# EAGLE design Mirtle_2018_drv8833 (EAGLE 6.6.0)
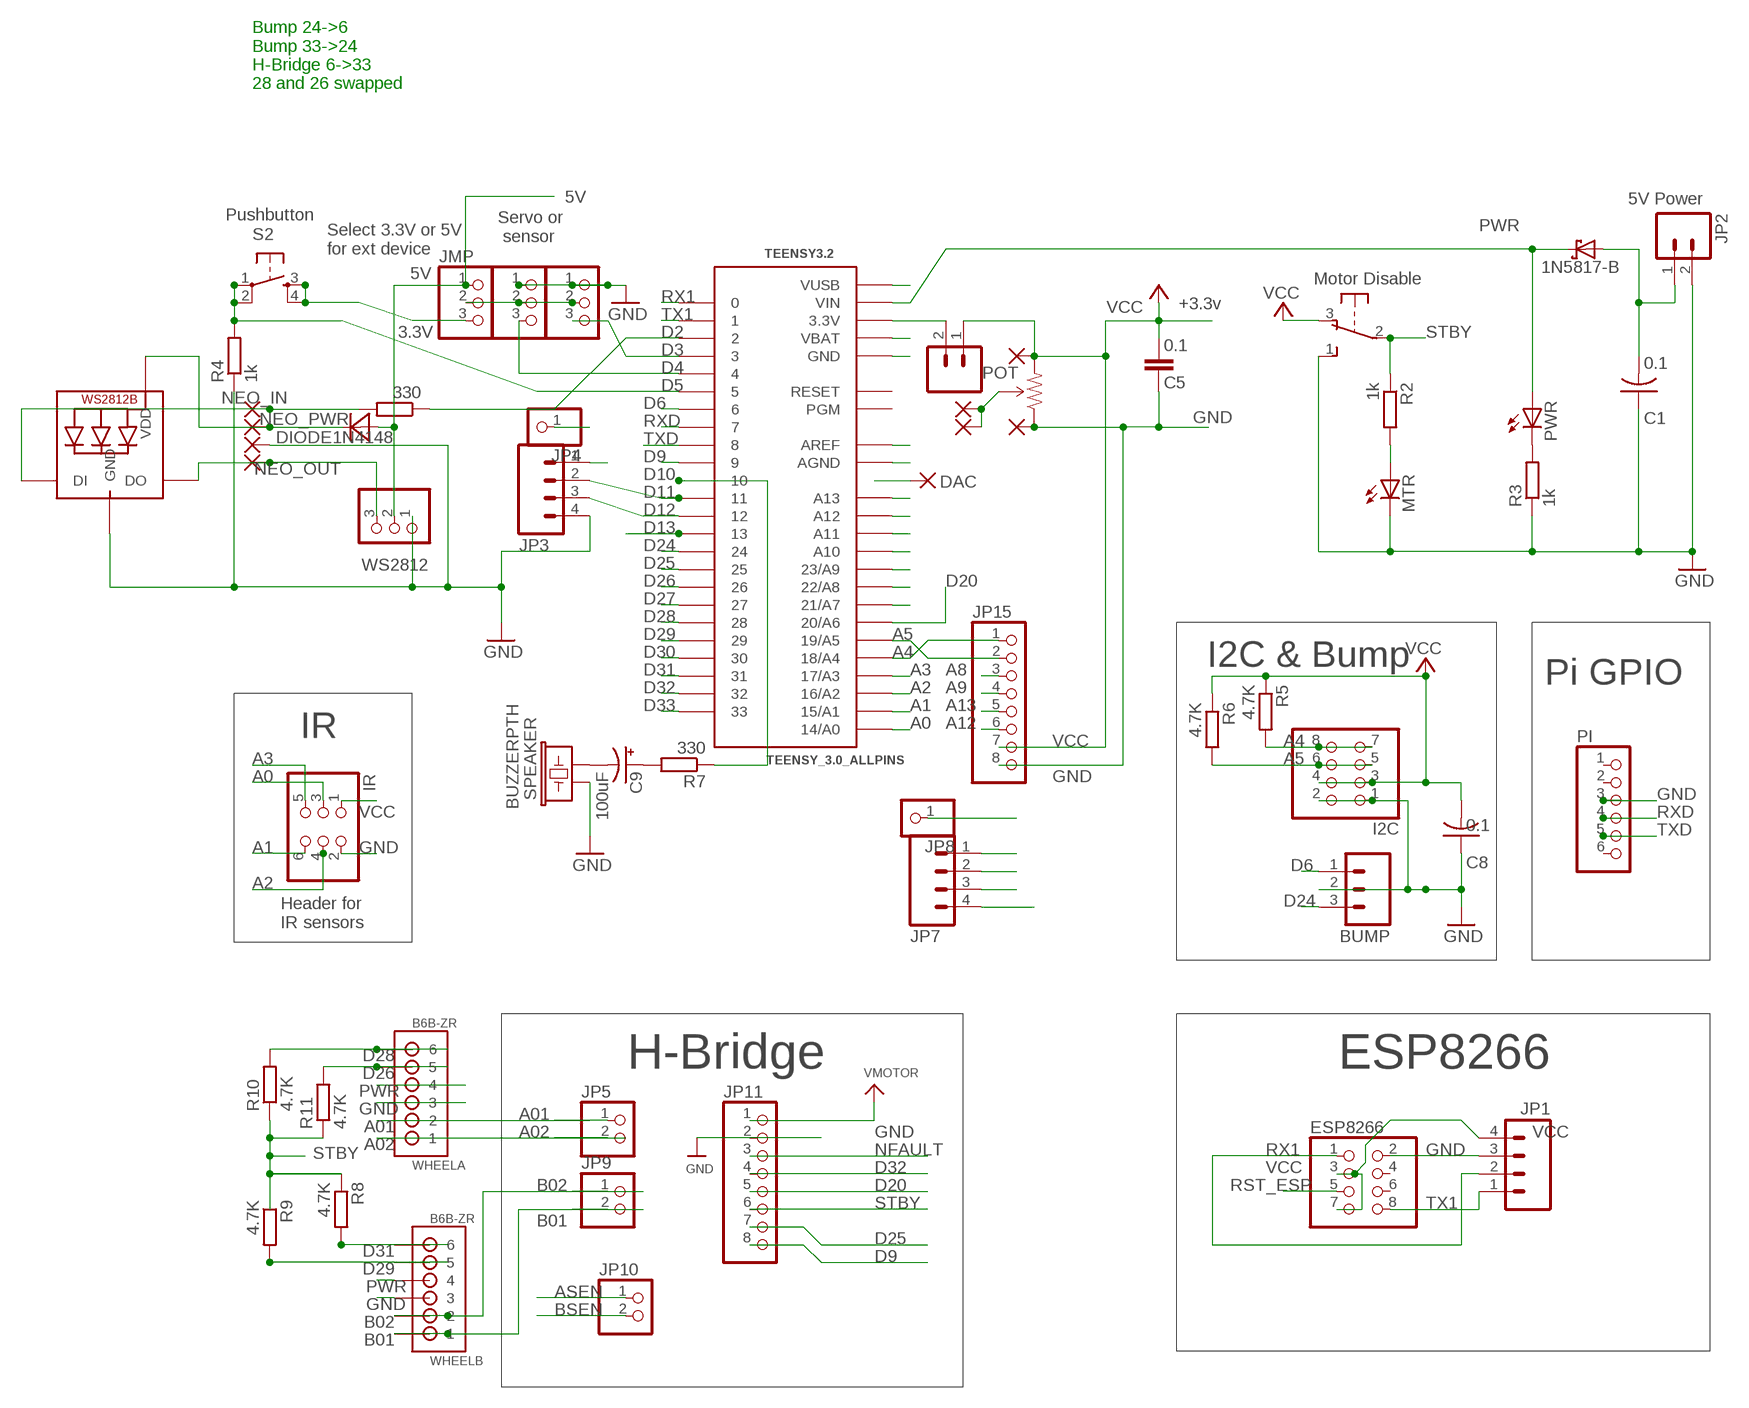
[diagram p0: schematic, sheet 1]

## Parts
3V3  M02PTH  [1X02]
BUMP  M03SCREW  [SCREWTERMINAL-3.5MM-3]
C1  0.1  C-US025-024X044  [C025-024X044]
C5  0.1  CAPEZ  [CAP-PTH-SMALLEZ]
C8  0.1  C-US025-024X044  [C025-024X044]
C9  100uF  CPOL-USE2.5-5  [E2,5-5]
D1  1N5817-B  [DO41-7.6]
D3  DIODE1N4148  [DO-35]
DAC  1,6/0,8  [1,6/0,8]
ESP8266  PINHD-2X4  [2X04]
EXT  PINHD-1X3  [1X03]
EXT1  PINHD-1X3  [1X03]
I2C  PINHD-2X4  [2X04]
IR  PINHD-2X3  [2X03]
JMP  PINHD-1X3  [1X03]
JP1  M04PTH  [1X04]
JP2  M023.5MM  [SCREWTERMINAL-3.5MM-2]
JP3  M04PTH  [1X04]
JP4  PINHD-1X1  [1X01]
JP5  HEADER-1X2ROUND  [1X02_ROUND]
JP7  M04PTH  [1X04]
JP8  PINHD-1X1  [1X01]
JP9  HEADER-1X2ROUND  [1X02_ROUND]
JP10  HEADER-1X2ROUND  [1X02_ROUND]
JP11  HEADER-1X870MIL  [1X08_ROUND_70]
JP15  PINHD-1X8BIG  [1X08-BIG]
LED1  WS2812B5050  [WS2812B]
MTR  LED3MM  [LED3MM]
PAD2  1,6/0,8  [1,6/0,8]
PAD3  1,6/0,8  [1,6/0,8]
PAD4  1,6/0,8  [1,6/0,8]
PAD5  1,6/0,8  [1,6/0,8]
PAD6  1,6/0,8  [1,6/0,8]
PAD7  1,6/0,8  [1,6/0,8]
PAD8  1,6/0,8  [1,6/0,8]
PAD9  1,6/0,8  [1,6/0,8]
PI  PINHD-1X6  [1X06]
POT  TSR-3386  TRIMPOT-PTH-KNOB  [3386U]
PWR  LED3MM  [LED3MM]
R2  1k  R-EU_0204/7  [0204/7]
R3  1k  R-EU_0204/7  [0204/7]
R4  1k  R-EU_0204/7  [0204/7]
R5  4.7K  R-EU_0204/7  [0204/7]
R6  4.7K  R-EU_0204/7  [0204/7]
R7  330  R-EU_0204/7  [0204/7]
R8  4.7K  R-EU_0204/5  [0204/5]
R9  4.7K  R-EU_0204/5  [0204/5]
R10  4.7K  R-EU_0204/5  [0204/5]
R11  4.7K  R-EU_0204/5  [0204/5]
R12  330  R-EU_0204/5  [0204/5]
S2  TAC_SWITCHPTH  [TACTILE-PTH]
SPEAKER  BUZZERPTH  [BUZZER-12MM]
SW1  OS102011MA1Q  [OS102011MA1Q]
TEENSY3.2  TEENSY_3.0_ALLPINS  [TEENSY_3.0_ALLPINS]
WHEELA  B6B-ZR  [B6B-ZR]
WHEELB  B6B-ZR  [B6B-ZR]
WS2812  PINHD-1X3  [1X03]

## Nets
5VIN: C1.2 D1.A JP2.1
A0: IR.3 TEENSY3.2.14/A0
A1: IR.6 TEENSY3.2.15/A1
A01: JP5.1 WHEELA.2
A2: IR.4 TEENSY3.2.16/A2
A02: JP5.2 WHEELA.1
A3: IR.5 TEENSY3.2.17/A3
A4: I2C.7 I2C.8 JP7.1 JP15.1 R5.2 TEENSY3.2.18/A4
A5: I2C.5 I2C.6 JP8.1 JP15.2 R6.2 TEENSY3.2.19/A5
A7: PAD6.1(P) PAD9.1(P) POT.2(WIPER) TEENSY3.2.21/A7
A8: JP15.3 TEENSY3.2.22/A8
A9: JP15.4 TEENSY3.2.23/A9
A10: TEENSY3.2.A10
A11: TEENSY3.2.A11
A12: JP15.6 TEENSY3.2.A12
A13: JP15.5 TEENSY3.2.A13
ASEN: JP10.1
B01: JP9.2 WHEELB.1
B02: JP9.1 WHEELB.2
BSEN: JP10.2
D2: R12.1 TEENSY3.2.2
D3: EXT.3 TEENSY3.2.3
D4: EXT1.3 TEENSY3.2.4
D5: R4.2 S2.1 S2.2 TEENSY3.2.5
D6: BUMP.1 TEENSY3.2.6
D9: JP11.8 TEENSY3.2.9
D10: R7.1 TEENSY3.2.10
D11: JP3.2 TEENSY3.2.11
D12: JP3.3 TEENSY3.2.12
D13: JP7.4 TEENSY3.2.13
D20: JP11.5 TEENSY3.2.20/A6
D24: BUMP.3 TEENSY3.2.24
D25: JP11.7 TEENSY3.2.25
D26: R11.2 TEENSY3.2.26 WHEELA.5
D27: TEENSY3.2.27
D28: R10.2 TEENSY3.2.28 WHEELA.6
D29: R9.2 TEENSY3.2.29 WHEELB.5
D30: TEENSY3.2.30
D31: R8.2 TEENSY3.2.31 WHEELB.6
D32: JP11.4 TEENSY3.2.32
D33: TEENSY3.2.33
GND: BUMP.2 C1.1 C5.1 C8.1 ESP8266.2 EXT1.1 EXT.1 I2C.1 I2C.2 IR.2 JP1.3 JP2.2 JP3.4 JP7.3 JP11.2 JP15.8 LED1.3-GND(GND) MTR.K(C) PAD4.1(P) PAD8.1(P) PI.3 POT.1(CCW) R3.1 R4.1 SPEAKER.+ SW1.1(S) TEENSY3.2.AGND TEENSY3.2.GND TEENSY3.2.GND1(GND) TEENSY3.2.GND2(GND) WHEELA.3 WHEELB.3 WS2812.1
N$2: TEENSY3.2.VUSB
N$3: PWR.K(C) R3.2
N$5: TEENSY3.2.VBAT
N$6: TEENSY3.2.AREF
N$7: 3V3.2 TEENSY3.2.3.3V TEENSY3.2.3.3V1(3.3V) TEENSY3.2.3.3V2(3.3V)
N$8: MTR.A R2.2
N$13: EXT1.2 EXT.2 JMP.2
N$15: C9.- SPEAKER.-
N$16: C9.+ R7.2
N$51: DAC.1(P)
NEO_IN: LED1.4-DIN(DI) PAD2.1(P) R12.2
NEO_OUT: LED1.2-DOUT(DO) PAD5.1(P) WS2812.3
NEO_PWR: D3.- LED1.1-VDD(VDD) PAD3.1(P)
NFAULT: JP11.3
PWR: D1.C D3.+ JMP.1 JP11.1 PWR.A TEENSY3.2.VIN WHEELA.4 WHEELB.4 WS2812.2 ; supply symbol labelled VMOTOR
RST_ESP: ESP8266.5
RX1: ESP8266.1 JP1.2 JP3.1 TEENSY3.2.0
RXD: PI.4 TEENSY3.2.7
STBY: JP11.6 R2.1 R8.1 R9.1 R10.1 R11.1 SW1.2(P)
TX1: ESP8266.8 JP1.1 JP4.1 TEENSY3.2.1
TXD: PI.5 TEENSY3.2.8
VCC: 3V3.1 C5.2 C8.2 ESP8266.3 ESP8266.7 I2C.3 I2C.4 IR.1 JMP.3 JP1.4 JP7.2 JP15.7 PAD7.1(P) POT.3(CW) R5.1 R6.1 S2.3 S2.4 SW1.3(O)
Unconnected: ESP8266.4 ESP8266.6 PI.1 PI.2 PI.6 SW1.MT1(MT) SW1.MT2(MT) TEENSY3.2.PGM TEENSY3.2.RESET

## Notes on the sheet
- Bump 24->6
  Bump 33->24
  H-Bridge 6->33
  28 and 26 swapped
- 5V | 5V Power
- Pushbutton
- Servo or
   sensor
- Select 3.3V or 5V
  for ext device
- 5V
- Motor Disable
- +3.3v
- 3.3V
- I2C & Bump
- Pi GPIO
- IR
- Header for
  IR sensors
- H-Bridge | ESP8266

## Library data of the parts
3V3 JP2 = SparkFun-Connectors:M02: Standard 2-pin 0.1" header. Use with - straight break away headers ( PRT-00116) - right angle break away headers (PRT-00553) - swiss pins (PRT-00743) - machine pins (PRT-00117) - female headers (PRT-00115) Molex polarized connector foot print use with: PRT-08233 with associated crimp pins and housings. 2.54_SCREWTERM for use with PRT-10571. 3.5mm Screw Terminal footprints for PRT-08084 5mm Screw Terminal footprints for use with PRT-08433
BUMP = SparkFun-Connectors:M03: Header 3 Standard 3-pin 0.1" header. Use with straight break away headers (SKU : PRT-00116), right angle break away headers (PRT-00553), swiss pins (PRT-00743), machine pins (PRT-00117), and female headers (PRT-00115). Molex polarized connector foot print use with SKU : PRT-08232 with associated crimp pins and housings.
C1 C8 = adafruit_mem:C-US: CAPACITOR, American symbol
C5 = SparkFun-Passives:CAP: Capacitor Standard 0603 ceramic capacitor, and 0.1" leaded capacitor.
C9 = adafruit:CPOL-US: POLARIZED CAPACITOR, American symbol
D1 = diode:1N581*: 1.0A SCHOTTKY BARRIER RECTIFIER Source: http://www.diodes.com/datasheets/ds23001.pdf
D3 = Diodes_monowave:DIODE: Diode; SPICE: D{NAME} {+.NET} {-.NET} 1N4148; SPICEMOD: .model 1N4148 D (IS=0.1PA, RS=16 CJO=2PF TT=12N BV=100 IBV=1nA)
DAC PAD2-PAD9 = wirepad:1,6/0,8: THROUGH-HOLE PAD
ESP8266 = adafruit_mem:PINHD-2X4: PIN HEADER
EXT EXT1 JMP WS2812 = adafruit:PINHD-1X3: PIN HEADER
I2C = adafruit:PINHD-2X4: PIN HEADER
IR = pinhead:PINHD-2X3: PIN HEADER
JP1 JP3 JP7 = SparkFun-Connectors:M04: Header 4 Standard 4-pin 0.1" header. Use with straight break away headers (SKU : PRT-00116), right angle break away headers (PRT-00553), swiss pins (PRT-00743), machine pins (PRT-00117), and female headers (PRT-00115). Molex polarized connector foot print use with SKU : PRT-08231 with associated crimp pins and housings. 1MM SMD Version SKU: PRT-10208
JP4 JP8 = adafruit_mem:PINHD-1X1: Pin header 1x1 for 0.1" spacing With round pins
JP5 JP9 JP10 = microbuilder:HEADER-1X2: PIN HEADER
JP11 = microbuilder:HEADER-1X8: PIN HEADER
JP15 = adafruit:PINHD-1X8: PIN HEADER
LED1 = adafruitx:WS2812B
MTR PWR = led:LED: LED OSRAM: - CHIPLED LG R971, LG N971, LY N971, LG Q971, LY Q971, LO R971, LY R971 LH N974, LH R974 LS Q976, LO Q976, LY Q976 LO Q996 - Hyper CHIPLED LW Q18S LB Q993, LB Q99A, LB R99A - SideLED LS A670, LO A670, LY A670, LG A670, LP A670 LB A673, LV A673, LT A673, LW A673 LH A674 LY A675 LS A676, LA A676, LO A676, LY A676, LW A676 LS A679, LY A679, LG A679 - Hyper Micro SIDELED® LS Y876, LA Y876, LO Y876, LY Y876 LT Y87S - SmartLED LW L88C, LW L88S LB L89C, LB L89S, LG L890 LS L89K, LO L89K, LY L89K LS L896, LA L896, LO L896, LY L896 - TOPLED LS T670, LO T670, LY T670, LG T670, LP T670 LSG T670, LSP T670, LSY T670, LOP T670, LYG T670 LG T671, LOG T671, LSG T671 LB T673, LV T673, LT T673, LW T673 LH T674 LS T676, LA T676, LO T676, LY T676, LB T676, LH T676, LSB T676, LW T676 LB T67C, LV T67C, LT T67C, LS T67K, LO T67K, LY T67K, LW E67C LS E67B, LA E67B, LO E67B, LY E67B, LB E67C, LV E67C, LT E67C LW T67C LS T679, LY T679, LG T679 LS T770, LO T770, LY T770, LG T770, LP T770 LB T773, LV T773, LT T773, LW T773 LH T774 LS E675, LA E675, LY E675, LS T675 LS T776, LA T776, LO T776, LY T776, LB T776 LHGB T686 LT T68C, LB T68C - Hyper Mini TOPLED® LB M676 - Mini TOPLED Santana® LG M470 LS M47K, LO M47K, LY M47K Source: http://www.osram.convergy.de LUXEON: - LUMILED® LXK2-PW12-R00, LXK2-PW12-S00, LXK2-PW14-U00, LXK2-PW14-V00 LXK2-PM12-R00, LXK2-PM12-S00, LXK2-PM14-U00 LXK2-PE12-Q00, LXK2-PE12-R00, LXK2-PE12-S00, LXK2-PE14-T00, LXK2-PE14-U00 LXK2-PB12-K00, LXK2-PB12-L00, LXK2-PB12-M00, LXK2-PB14-N00, LXK2-PB14-P00, LXK2-PB14-Q00 LXK2-PR12-L00, LXK2-PR12-M00, LXK2-PR14-Q00, LXK2-PR14-R00 LXK2-PD12-Q00, LXK2-PD12-R00, LXK2-PD12-S00 LXK2-PH12-R00, LXK2-PH12-S00 LXK2-PL12-P00, LXK2-PL12-Q00, LXK2-PL12-R00 Source: www.luxeon.com KINGBRIGHT: KA-3528ASYC Source: www.kingbright.com
PI = adafruit:PINHD-1X6: PIN HEADER
POT = SparkFun-Electromechanical:TRIMPOT: Various small potentiometers for "set-and-forget" applications; PROD_ID: RES-09730
R2-R12 = resistor:R-EU_: RESISTOR, European symbol
S2 = SparkFun-Electromechanical:TAC_SWITCH: Momentary Switch Button commonly used for reset or general input. Spark Fun Electronics SKU : COM-00097 SMT- SWCH-08247
SPEAKER = SparkFun-Electromechanical:BUZZER: Buzzer 12mm Spark Fun Electronics SKU : Comp-Buzzer
SW1 = adafruit_mem:OS102011MA1Q: OS10201MA1Q through-hole right angle switch http://www.ladyada.net/library/eagle
TEENSY3.2 = Teensy3.0:TEENSY_3.0_ALLPINS: Teensy 3.0 with all pin holes and optional SMD-mount unshrouded header on bottom of Teensy 3.0. For more basic versions, see 'Basic', '+4' and 'AllAnalogPins'. Requires the installation of a un-shrouded SMD header on the underside of the Teensy 3.0
WHEELA WHEELB = jst:B6B-ZR: JST-ZH Connector 6 pol, 1.5mm pitch Package: B6B-ZR Source: http://www.jst-mfg.com/product/pdf/eng/eZH.pdf

## Net classes
1 power: width 0.305 mm, clearance 0.305 mm

## Board
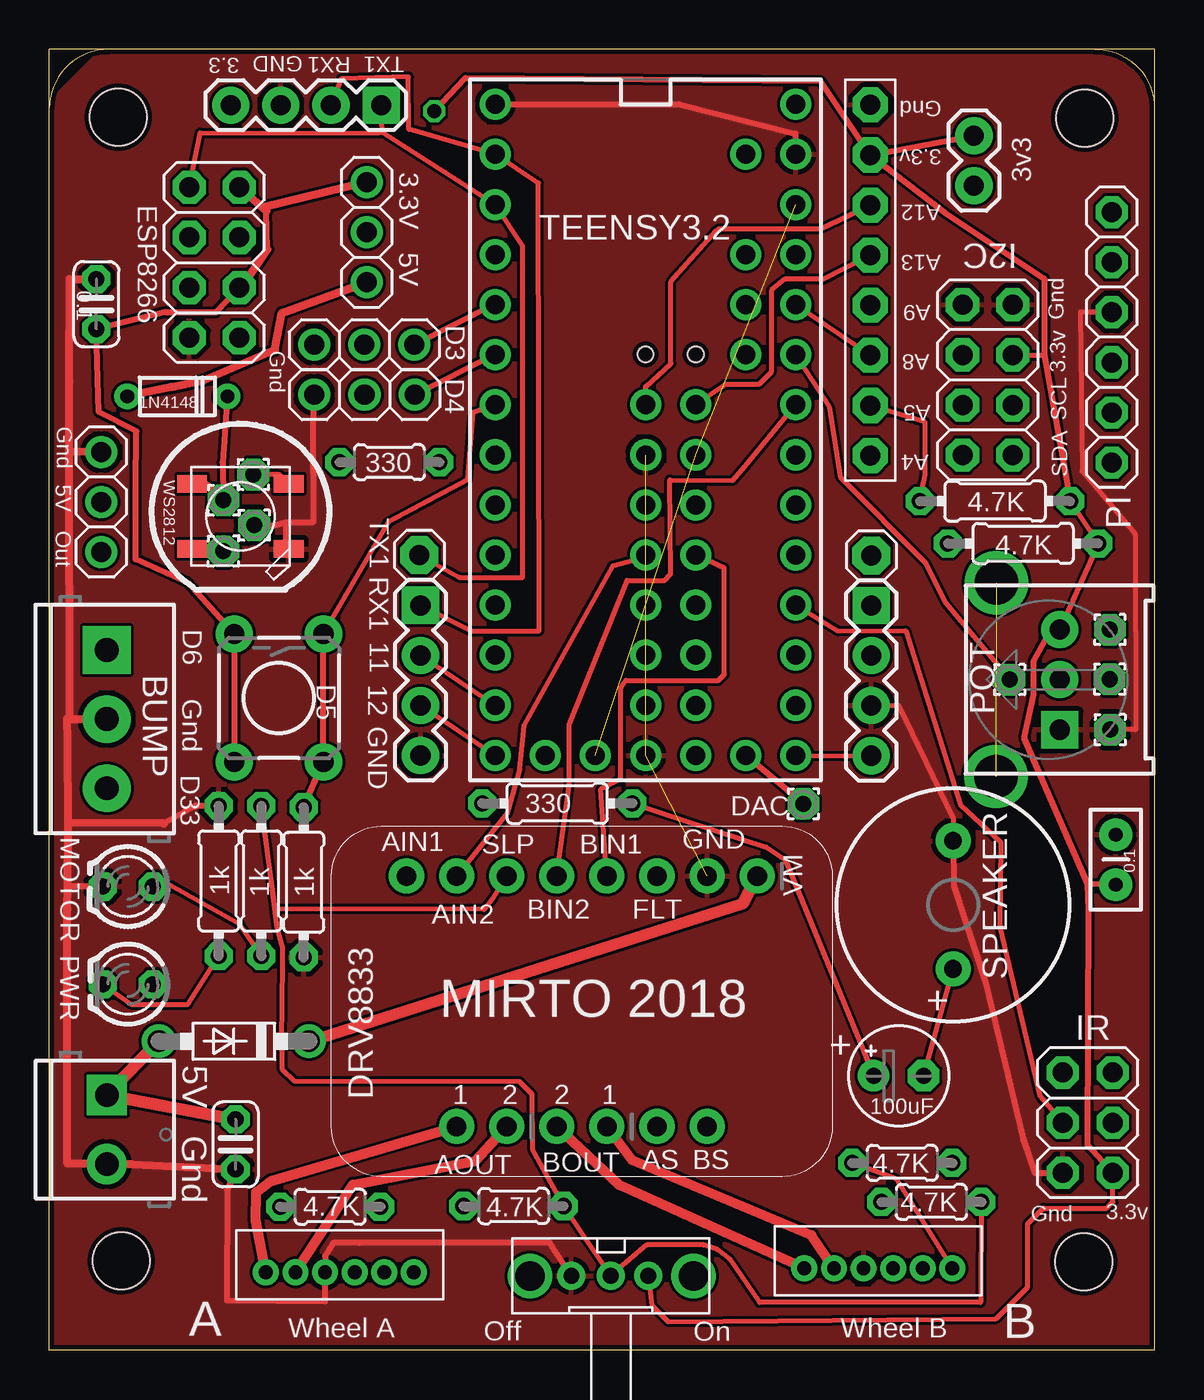
[diagram p1: board, top side]
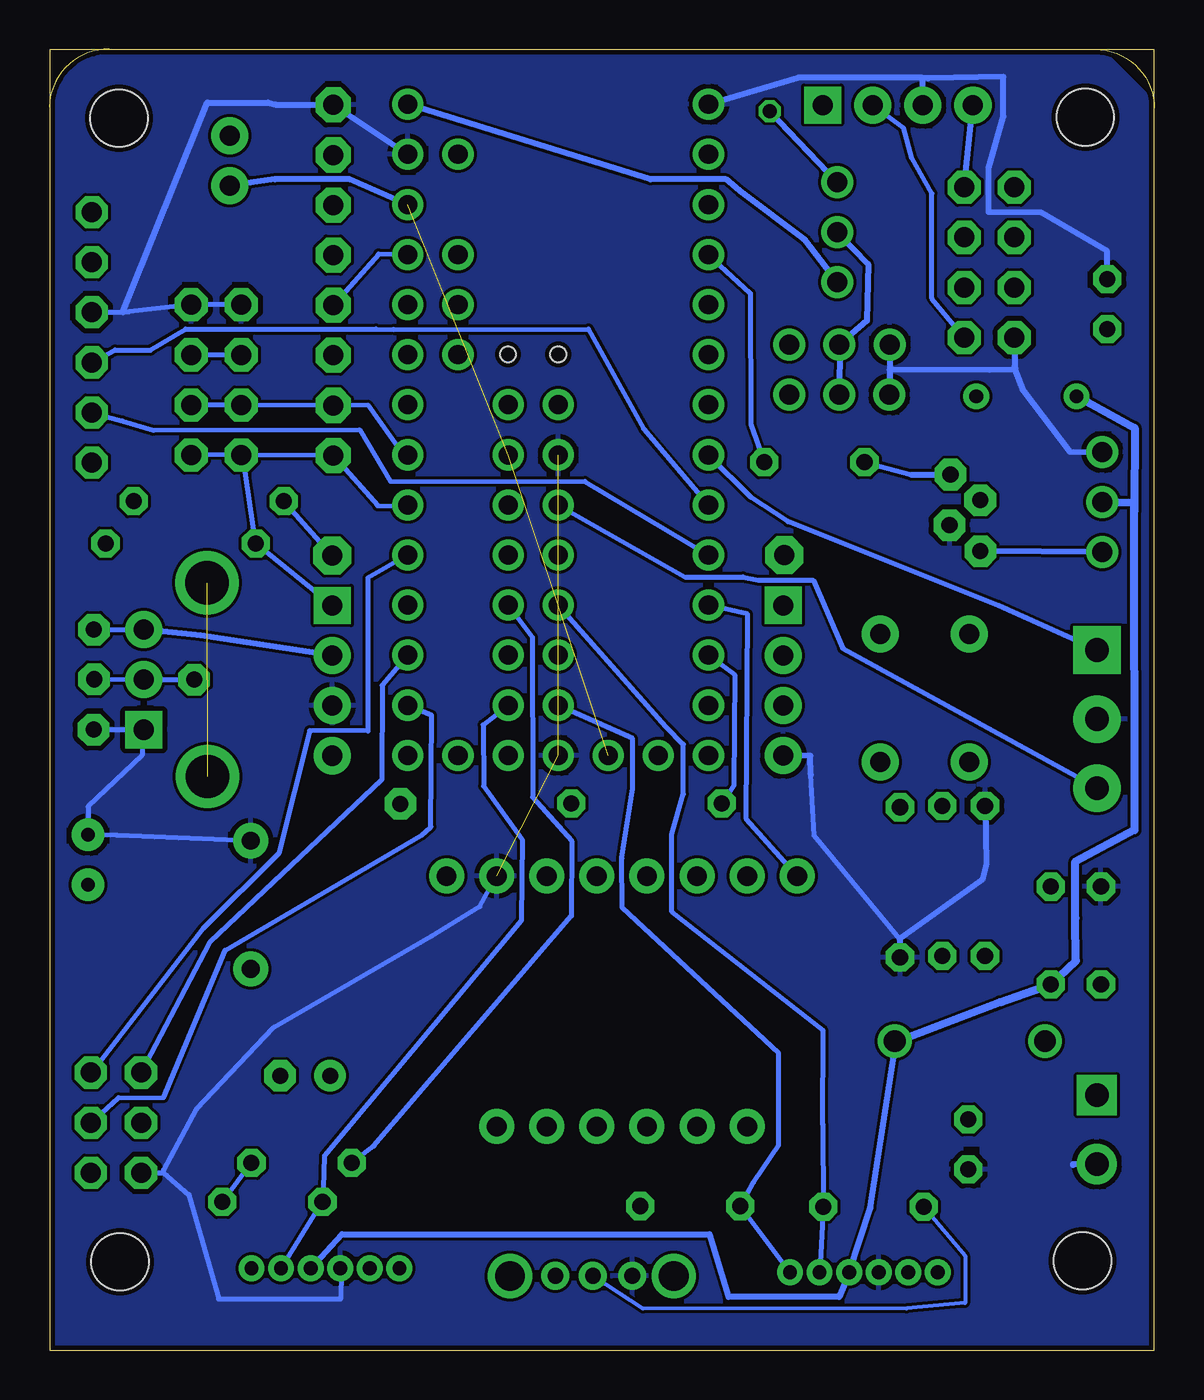
[diagram p2: board, bottom side, seen from below]

Size 56.03 x 65.98 mm. Coordinates in mm from the lower left corner, seen from the top.
Outline: 53,65.98 56.02,65.98 56.01,0 0,0 0,62.98
Outline: 53,65.98 3,65.98
Outline: 3,65.98 0,65.98 0,62.98
Outline: 3,65.98 arc90 0,62.98
Outline: 53,65.98 arc-90 56.03,63.04
Copper layers (1*16): Top 0.035mm / dielectric 1.5mm / Bottom 0.035mm
Design rules "DFRobot_Eagle_Rule_v0.4": minimum track width 6mil, minimum drill 12mil, track to track 6mil, track to pad 6mil, pad to pad 6mil, via to via 6mil, smd to smd 0mil, copper to edge 10mil, drill to drill 10mil, minimum pad ring 12mil, minimum via ring 8mil, stop-mask expansion 2mil, vias tented up to drill 25mil, thermal gap 10mil
Holes 2.9 mm at 52.5,62.48 3.65,4.53 3.5,62.53 52.45,4.48
Holes 0.8 mm at 30.23,50.51 32.77,50.51
tRestrict: area 2.5,9.9 to 3.3,10.7; area 2.5,8.2 to 3.3,9; area 8.8,8.2 to 9.7,9; area 9.5,8.9 to 10.3,9.7; area 40.9,3.2 to 41.7,4; area 51,7.9 to 51.8,8.7; area 51.6,8.6 to 52.5,9.4; area 46.1,25.4 to 46.9,26.2; area 45.4,26.2 to 46.2,27; area 53.4,30.4 to 54.2,31.2; area 54,31 to 54.8,31.8; area 53.3,31.7 to 54.1,32.5; 55 more areas
bRestrict: area 8.9,9.5 to 9.7,10.3; area 12.4,50.6 to 13.2,51.4; area 13.7,50.6 to 14.4,51.4; area 13.1,51.2 to 13.8,52; area 12.4,48 to 13.2,48.8; area 12.9,47.5 to 13.8,48.3; area 13.7,48 to 14.5,48.8; area 7.4,50.9 to 8.2,51.7; area 6,51 to 6.8,51.8; area 6.7,51.6 to 7.5,52.5; area 2,53.4 to 2.8,54.2; area 2.6,53.9 to 3.4,54.7; 58 more areas

### Footprints (pad centres in the part's own frame; a part is rotated, then mirrored left to right if it is on the bottom)
1X02 = drill 1.016 pad 1.88: 1 0,0; 2 2.54,0
SCREWTERMINAL-3.5MM-3 = drill 1.2 pad 2.413 square: 1 0,0 | drill 1.2 pad 2.413: 2 3.5,0; 3 7,0
C025-024X044 = drill 0.813 pad 1.422 octagon: 1 -1.27,0; 2 1.27,0
CAP-PTH-SMALLEZ = drill 0.7 pad 1.651: 1 0,0; 2 2.54,0
E2,5-5 = drill 0.813 pad 1.6: + -1.27,0 | drill 0.813 pad 1.6 octagon: - 1.27,0
DO41-7.6 = drill 1.1 pad 1.7: A 3.81,0; C -3.81,0
DO-35 = drill 0.7: + -2.54,0; - 2.54,0
1,6/0,8 = drill 0.813 pad 1.6 octagon: 1 0,0
2X04 = drill 1.016 pad 1.676 octagon: 1 -3.81,-1.27; 2 -3.81,1.27; 3 -1.27,-1.27; 4 -1.27,1.27; 5 1.27,-1.27; 6 1.27,1.27; 7 3.81,-1.27; 8 3.81,1.27
1X03 = drill 1.016: 1 -2.54,0; 2 0,0; 3 2.54,0
2X03 = drill 1.016 octagon: 1 -2.54,-1.27; 2 -2.54,1.27; 3 0,-1.27; 4 0,1.27; 5 2.54,-1.27; 6 2.54,1.27
1X04 = drill 1.016 pad 1.88 square: 1 0,0 | drill 1.016 pad 1.88: 2 2.54,0; 3 5.08,0; 4 7.62,0
SCREWTERMINAL-3.5MM-2 = drill 1.2 pad 2.032 square: 1 0,0 | drill 1.2 pad 2.032: 2 3.5,0
1X01 = drill 1.016 pad 1.93 octagon: 1 0,0
1X02_ROUND = drill 1 pad 1.778: 1 -1.27,0; 2 1.27,0
1X08_ROUND_70 = drill 1 pad 1.778: 1 -8.89,0; 2 -6.35,0; 3 -3.81,0; 4 -1.27,0; 5 1.27,0; 6 3.81,0; 7 6.35,0; 8 8.89,0
1X08-BIG = drill 1.016 pad 1.778 octagon: 1 -8.89,0; 2 -6.35,0; 3 -3.81,0; 4 -1.27,0; 5 1.27,0; 6 3.81,0; 7 6.35,0; 8 8.89,0
WS2812B = smd 1.5 x 0.9: 1-VDD 2.45,-1.65; 2-DOUT 2.45,1.65; 3-GND -2.45,1.65; 4-DIN -2.45,-1.65
LED3MM = drill 0.813 octagon: A -1.27,0; K 1.27,0
1X06 = drill 1.016 octagon: 1 -6.35,0; 2 -3.81,0; 3 -1.27,0; 4 1.27,0; 5 3.81,0; 6 6.35,0
3386U = drill 1.016 pad 1.88 square: 1 -2.54,-0.015 | drill 1.016 pad 1.88: 2 0,-0.015; 3 2.54,-0.015
0204/7 = drill 0.813 octagon: 1 -3.81,0; 2 3.81,0
0204/5 = drill 0.813 octagon: 1 -2.54,0; 2 2.54,0
TACTILE-PTH = drill 1.016 pad 1.88: 1 -3.251,2.261; 2 3.251,2.261; 3 -3.251,-2.261; 4 3.251,-2.261
BUZZER-12MM = drill 0.9 pad 1.778: + 3.25,0; - -3.25,0
OS102011MA1Q = drill 0.8 pad 1.422: 1 -2,0; 2 0,0; 3 1.9,0 | drill 1.5 pad 2.184: MT1 -4.1,0; MT2 4.2,0
TEENSY_3.0_ALLPINS = drill 0.965: 0 -7.62,13.97; 1 -7.62,11.43; 2 -7.62,8.89; 3 -7.62,6.35; 3.3V 7.62,11.43; 3.3V1 -2.54,-16.51; 3.3V2 2.54,-1.27; 4 -7.62,3.81; 5 -7.62,1.27; 6 -7.62,-1.27; 7 -7.62,-3.81; 8 -7.62,-6.35; 9 -7.62,-8.89; 10 -7.62,-11.43; 11 -7.62,-13.97; 12 -7.62,-16.51; 13 7.62,-16.51; 14/A0 7.62,-13.97; 15/A1 7.62,-11.43; 16/A2 7.62,-8.89; 17/A3 7.62,-6.35; 18/A4 7.62,-3.81; 19/A5 7.62,-1.27; 20/A6 7.62,1.27; 21/A7 7.62,3.81; 22/A8 7.62,6.35; 23/A9 7.62,8.89; 24 0,-3.81; 25 0,-6.35; 26 0,-8.89; 27 0,-11.43; 28 0,-13.97; 29 2.54,-13.97; 30 2.54,-11.43; 31 2.54,-8.89; 32 2.54,-6.35; 33 2.54,-3.81; A10 5.08,6.35; A11 5.08,3.81; A12 0,1.27; A13 2.54,1.27; AGND 7.62,13.97; AREF 5.08,8.89; GND -7.62,16.51; GND1 0,-16.51; GND2 0,-1.27; PGM 2.54,-16.51; RESET 5.08,-16.51; VBAT -5.08,-16.51; VIN 7.62,16.51; VUSB 5.08,13.97
B6B-ZR = drill 0.7: 1 9,-1.3; 2 7.5,-1.3; 3 6,-1.3; 4 4.5,-1.3; 5 3,-1.3; 6 1.5,-1.3

### Placement (x,y rotation side)
3V3  46.88,61.6 270 top
BUMP  2.91,35.51 270 top
C1  9.44,10.44 90 top
C5  54.07,26.15 270 top
C8  2.39,53.06 270 top
C9  43.06,13.92 0 top
D1  9.36,15.67 180 top
D3  6.49,48.38 0 top
DAC  38.23,27.71 0 top
ESP8266  8.37,55.17 90 top
EXT  15.97,51.01 0 top
EXT1  15.98,48.46 0 top
I2C  47.57,49.21 270 top
IR  52.65,11.54 90 top
JMP  16.09,56.7 90 top
JP1  16.82,63.15 180 top
JP2  2.92,12.94 270 top
JP3  18.82,37.78 270 top
JP4  18.76,40.32 0 top
JP5  21.92,11.35 180 top
JP7  41.68,37.77 270 top
JP8  41.68,40.3 0 top
JP9  27,11.35 180 top
JP10  32.08,11.35 0 top
JP11  27,24.05 180 top
JP15  41.63,54.27 90 top
LED1  9.69,42.29 180 top
MTR  3.98,23.51 180 top
PAD2  10.34,44.41 0 top
PAD3  8.83,43.11 0 top
PAD4  10.39,41.84 0 top
PAD5  8.82,40.53 0 top
PAD6  48.69,34.01 0 top
PAD7  53.77,36.55 0 top
PAD8  53.78,31.47 0 top
PAD9  53.76,34.03 0 top
PI  53.87,51.37 270 top
POT  51.22,34.01 90 top
PWR  3.98,18.56 180 top
R2  10.75,23.8 270 top
R3  8.59,23.8 270 top
R4  12.9,23.73 90 top
R5  49.37,40.92 180 top
R6  47.95,43.06 180 top
R7  25.75,27.74 0 top
R8  43.24,9.5 180 top
R9  44.72,7.52 180 top
R10  23.54,7.31 180 top
R11  14.24,7.28 0 top
R12  17.24,45.04 180 top
S2  11.64,33.08 270 top
SPEAKER  45.82,22.59 90 top
SW1  28.47,3.77 0 top
TEENSY3.2  30.23,46.68 0 top
WHEELA  19.98,2.65 180 top
WHEELB  47.28,2.86 180 top
WS2812  2.64,43.02 270 top

### Tracks (layer width: path | path; a pad name or v marks a point on that pad's centre or on a via)
5VIN
  Top 0.61: C1.2 JP2.1 D1.A
A0
  Bottom 0.254: IR.3 52.53,12.81 50.23,12.82 47.12,20.28 37.17,26.12 36.68,26.55 36.65,32.2 TEENSY3.2.14/A0
A1
  Bottom 0.254: TEENSY3.2.15/A1 39.16,33.73 39.18,28.91 47.89,20.69 IR.6
A01
  Top 0.508: WHEELA.2 15.39,8.4 21.6,9.6 JP5.1
A2
  Top 0.254: TEENSY3.2.16/A2 39.97,36.48 43.42,36.49 46.19,27.67 48.23,25.77 48.2,21.47 50.22,12.89 IR.4
A02
  Top 0.508: WHEELA.1 10.46,6.62 10.48,8.02 11.24,8.58 JP5.2
A3
  Bottom 0.254: TEENSY3.2.17/A3 39.88,39.17 39.88,31.4 42.83,31.42 44.41,25.19 48.26,21.36 53.89,14.1 IR.5
A4
  Bottom 0.254: TEENSY3.2.18/A4 37.91,42.81 39.39,42.83 JP15.1 I2C.7 46.37,45.42 | 46.37,45.42 46.2,45.25 R5.2 JP7.1 | 46.37,45.42 I2C.8
A5
  Top 0.254: R6.2 44.4,44.41 44.4,47.07 JP15.2
  Bottom 0.254: TEENSY3.2.19/A5 38.07,45.41 39.87,47.93 JP15.2 I2C.5 I2C.6 | JP8.1 R6.2
A7
  Top 0.254: TEENSY3.2.21/A7 39.56,47.82 40.13,44.27 44.44,39.92 45.43,37.91 PAD6.1
  Bottom 0.254: PAD9.1 POT.2 PAD6.1
A8
  Top 0.254: TEENSY3.2.22/A8 JP15.3
A9
  Bottom 0.254: TEENSY3.2.23/A9 39.33,55.6 JP15.4
A12
  Top 0.254: TEENSY3.2.A12 30.23,48.88 31.51,50.05 31.52,54.18 33.81,56.79 33.95,56.87 39.11,56.87 41.08,57.81 JP15.6
A13
  Top 0.254: TEENSY3.2.A13 34.26,48.98 35.96,48.98 36.6,49.6 36.61,53.76 37.28,54.31 39.17,54.31 39.14,54.27 JP15.5
B01
  Top 0.508: WHEELB.1 28.92,8.37 JP9.2
B02
  Top 0.508: WHEELB.2 38.64,5.83 29.55,9.64 JP9.1
D2
  Bottom 0.254: TEENSY3.2.2 20.49,53.6 20.46,46.98 R12.1
D3
  Top 0.305: EXT.3 22.61,53.07 TEENSY3.2.3
D4
  Top 0.305: EXT1.3 22.61,50.52 TEENSY3.2.4
D5
  Top 0.254: S2.1 17.21,42.02 21.21,44.15 21.49,47.57 TEENSY3.2.5
  Top 0.305: S2.1 S2.2 R4.2
D6
  Bottom 0.254: TEENSY3.2.6 20.46,43.26 18.57,42.02 7.91,37.77 BUMP.1
D9
  Bottom 0.254: JP11.8 20.69,26.94 20.63,37.33 TEENSY3.2.9
D10
  Bottom 0.254: R7.1 21.31,28.67 21.26,34.24 TEENSY3.2.10
D11
  Top 0.254: JP3.2 TEENSY3.2.11
D12
  Top 0.254: JP3.3 TEENSY3.2.12
D13
  Top 0.254: TEENSY3.2.13 JP7.4
D20
  Top 0.254: 35.27,44.82 35.28,44.84 | 35.28,44.84 TEENSY3.2.20/A6 | JP11.5 26.35,28.65 26.35,31.73 29.29,39.04 31.19,39.05 31.51,39.37 31.46,44.14 34.65,44.11 35.28,44.84
D24
  Bottom 0.254: BUMP.3 15.81,35.6 17.31,39.05 20.08,39.05 20.87,39.22 23.78,39.21 TEENSY3.2.24
D25
  Top 0.254: TEENSY3.2.25 29.91,40.14 28.59,39.79 24.07,31.69 23.85,29.5 23.23,27.24 JP11.7
D26
  Bottom 0.254: TEENSY3.2.26 24.76,31.62 23.88,30.73 23.88,28.2 24.48,26.16 24.46,22.23 16.79,16.22 16.81,11.44 R11.2 WHEELA.5
D28
  Bottom 0.254: TEENSY3.2.28 26.46,31.02 26.45,28.49 27,24.96 26.98,22.42 19.05,15.05 19.05,10.41 20.33,8.51 R10.2 WHEELA.6
D29
  Bottom 0.254: TEENSY3.2.29 34.04,31.72 34.01,28.61 32.06,25.91 32.09,21.8 42.09,9.86 42.17,7.4 R9.2 WHEELB.5
D31
  Top 0.254: WHEELB.6 42.93,8.69 R8.2
  Bottom 0.254: TEENSY3.2.31 31.54,36.17 31.52,28.04 29.55,25.84 29.56,22.02 39.58,10.36 R8.2
D32
  Top 0.254: JP11.4 27.97,28.46 28.98,28.96 28.98,33.6 29.23,33.97 33.91,33.96 34.23,34.28 34.21,39.68 TEENSY3.2.32
GND  (2 unrouted)
  Top 0.254: 37.87,60.67 TEENSY3.2.AGND | PI.3 52.28,52.66 52.36,44.58 55.05,41.39 55.08,31.47 PAD8.1 | LED1.3-GND 11.99,40.79 11.99,42 | SPEAKER.+ 45.85,26.95 43.08,32.68 JP7.3
  Top 0.305: BUMP.2 1.03,32.02 | R3.1 7.36,27.6 7.36,27.57 5.81,26.71 | TEENSY3.2.GND 31.92,63.2 37.82,61.71 37.82,60.65 TEENSY3.2.AGND | PAD4.1 11.47,41.84 11.99,42 13.4,42.01 13.38,46.85 13.44,48.39 EXT1.1 | C1.1 9.02,8.13 9,2.53 13.99,2.48 WHEELA.3 13.99,4.78 14.4,5.44 15.72,5.44 25.37,5.45 SW1.1 | SPEAKER.+ 45.84,25.68 | SPEAKER.+ 45.84,25.68 | SPEAKER.+ 45.86,23.54 47.47,18.61 49.37,10.69 49.97,8.99 IR.2 | MTR.K 0.93,23.53
  Top 0.406: 0.96,26.75 0.96,26.4 0.93,23.53 0.91,22.37 0.91,9.46 JP2.2 4.18,9.44 4.18,9.43 C1.1 | 0.96,26.75 0.93,30.9 0.9,32.02 BUMP.2 | 1.03,32.02 1,45.57 | 1,45.57 1.02,49.13 1.03,54.33 C8.1 | 5.81,26.71 0.96,26.75 | WS2812.1 1,45.57
  Bottom 0.254: PAD8.1 POT.1 51.33,31.47 51.33,30.17 54.06,27.57 C5.1 52.59,26.12 SPEAKER.+ | PI.3 52.3,52.64 51.98,52.67 | IR.2 50.23,9 | 50.23,9 50.23,9.16 48.57,12.21 44.65,16.38 36.65,21.01 34.2,22.5 JP11.2 | I2C.1 I2C.2 51.98,52.67 | 12.92,20.86 17.25,26.1 17.42,29.2 | 51.98,52.67 52.33,52.63 | 50.23,9 48.96,7.89 47.44,2.6 41.26,2.6 41.24,3.96
  Bottom 0.305: EXT.1 13.43,49.72 | 13.43,49.72 EXT1.1 | ESP8266.2 7.09,49.92 7.06,49.73 | 7.06,49.73 6.63,48.65 4.29,45.57 WS2812.1 | R3.1 8.52,24.66 8.73,23.86 12.92,20.86 R4.1 | 52.3,52.64 48.02,63.28 44.94,63.28 44.55,63.18 JP15.8 TEENSY3.2.AGND | 7.06,49.73 8.36,49.71 13.43,49.72 | 4.12,9.4 4.12,9.44 JP2.2 | JP1.3 11.74,64.53 | 11.74,64.53 18.09,64.53 TEENSY3.2.GND | C8.1 2.4,55.74 5.74,57.7 8.41,57.73 8.41,59.97 7.66,62.57 7.66,64.58 11.47,64.51 11.74,64.53 | 17.42,29.2 17.45,30.14 JP3.4 | WHEELB.3 41.24,3.96
  pour Top: 0,0 0,63.21 2.54,65.75 54.61,65.75 55.88,64.48 55.88,0
  pour Bottom: 0,0 0,63.21 2.54,65.75 54.61,65.75 55.88,64.48 55.88,0
N$3
  Top 0.254: PWR.K 4.16,17.55 7.03,17.55 R3.2
N$7  (2 unrouted)
  Bottom 0.305: TEENSY3.2.3.3V 40.79,59.39 44.59,59.39 3V3.2
N$8
  Top 0.254: R2.2 9.66,21.6 6.14,23.56 MTR.A
N$13
  Bottom 0.305: EXT.2 15.95,51.02 | 15.95,51.02 EXT1.2 | JMP.2 14.51,55.09 14.58,52.21 15.95,51.02
N$15
  Top 0.254: C9.- SPEAKER.-
N$16
  Top 0.254: R7.2 36.37,25.5 37.3,24.87 C9.+
N$51
  Top 0.305: DAC.1 37.22,28.58 35.28,30.18
N$99  (via drill 2.2)  (1 unrouted)
  other vias: 48.03,38.92 48,29.1
NEO_IN
  Top 0.254: LED1.4-DIN 11.67,44.41 PAD2.1
  Bottom 0.254: R12.2 12.32,44.41
  Bottom 0.305: 12.32,44.41 PAD2.1
NEO_OUT
  Top 0.254: LED1.2-DOUT 8.71,40.64 PAD5.1
  Bottom 0.305: WS2812.3 PAD5.1
NEO_PWR
  Top 0.254: LED1.1-VDD 8,43.94 PAD3.1
  Top 0.305: D3.- 8.79,45.02 PAD3.1
PWR
  Top 0.406: JMP.1 11.79,52.61 11.44,50.74 7.82,49.2 6.18,48.85 D3.+
  Top 0.61: D1.C 35.18,22.66 JP11.1
  Bottom 0.305: WHEELB.4 41.2,5.89 22.55,5.88 21.59,2.7 15.99,2.7 WHEELA.4 14.4,7.2 13.08,15.71 | TEENSY3.2.VIN 25.55,59.39 21.72,59.39 21.03,58.81 17.76,56.35 JMP.1
  Bottom 0.406: 1.01,26.38 1.01,26.4 | 1.01,26.4 1.01,42.56 | 1.01,42.56 1.01,42.97 WS2812.2 | D3.+ 1,46.78 1.01,42.56 | D1.C 13.08,15.71 12.89,15.71 7.83,17.65 PWR.A 3.98,19.75 4.01,21.9 4.01,24.78 1.01,26.4
RX1
  Top 0.254: JP1.2 14.8,64.48 18.2,64.58 18.23,61.92 TEENSY3.2.0 24.8,59.2 24.83,36.48 21.38,36.48 JP3.1
  Bottom 0.254: ESP8266.1 11.28,53.34 11.29,58.67 12.31,60.47 12.71,61.98 JP1.2
RXD
  Bottom 0.254: PI.4 52.69,50.73 50.91,50.72 49.12,51.79 39.46,51.79 38.57,51.77 28.7,51.79 25.9,46.72 TEENSY3.2.7
STBY
  Top 0.254: JP11.6 22.48,22.91 22.04,22.35 11.45,22.37 R2.1 11.54,21.41 11.81,20.44 11.79,16.84 11.77,16.49 11.79,14.28 12.42,13.65 23.83,13.63 24.46,13 24.49,10.2 R10.1 27.14,5.71 SW1.2 28.72,4.01 30.29,5.34 33.17,5.34 33.86,5.11 34.52,4.6 36.01,2.43 47.22,2.43 R9.1
  Bottom 0.203: R11.1 9.6,4.8 9.6,2.4 12.57,2.12 25.92,2.11 SW1.2
  Bottom 0.254: R8.1 R9.1
TX1
  Top 0.254: ESP8266.8 7.65,61.73 16.68,61.74 16.87,61.76 | 16.87,61.76 16.91,61.75 20.08,59.73 TEENSY3.2.1 24,56 24,39.2 20.8,39.2 JP4.1 | 16.87,61.76 JP1.1
TXD
  Bottom 0.254: PI.5 52.31,47.13 50.75,46.66 40.3,46.68 38.74,44.07 28.88,44.06 TEENSY3.2.8
VCC  (via drill 0.7)
  Top 0.254: R6.1 R5.1 POT.3 | I2C.4 50.44,50.48 | SW1.3 30.55,2.27 31.38,1.45 48,1.6 49.6,3.2 49.6,6.4 50.4,7.2 53.6,7.2 53.92,7.52 IR.1
  Top 0.305: 10,54.27 ESP8266.3 8.44,52.64 5.89,52.65 C8.2 2.51,47.58 4.42,46.61 4.38,43.69 4.38,40.12 7.03,38.93 S2.3 S2.4 | 11.05,55.83 11,57.78 | IR.1 52.64,10.38 52.69,22.3 52.66,23.64 | 52.66,23.64 49.43,31.06 49.9,33.26 49.91,34.95 50.63,36.24 POT.3 | C5.2 52.66,23.64 | R6.1 50.44,50.48 50.44,54.36 45.39,57.7 JP15.7 | JP15.7 3V3.1 | JP15.7 39.1,64.37 21.1,64.52 v19.51,62.84
  Top 0.406: 10,54.27 11.05,55.83 | 11,57.78 10.8,57.95 | 10.8,57.95 ESP8266.7 | JMP.3 10.8,57.95
  Bottom 0.254: PAD7.1 POT.3 | I2C.3 I2C.4
  Bottom 0.305: ESP8266.7 JP1.4 | v19.51,62.84 JMP.3 | JP7.2 48.36,36.26 POT.3

### Text on the board
tPlace: AIN1 | SLP | BIN1 | GND | VM | AIN2 | BIN2 | FLT | MIRTO 2018 | DRV8833 | 1 | 2 | 2 | 1 | AOUT | BOUT | AS | BS
tNames: 3.3 | GND | RX1 | TX1 | Gnd | 3.3v | 3.3V | 3v3 | A12 | 5V | A13 | A9 | D3 | Gnd | Gnd | A8 | 3.3v | D4 | 1N4148 | A5 | Gnd | SCL | A4 | 5V | SDA | Out | TX1 | RX1 | D6 | 11 | D5 | 12 | Gnd | GND | D33 | MOTOR | + | + | 5V | Gnd | Gnd | 3.3v | A | Wheel A | Wheel B | B | Off | On
Document: Mod for new pinout: / cut trace to pin 4 and connect to pin 2 / cut trace from servo and connect to pin 4 (note wrong labels for servo pins) / connect trace to 20 (A6) - note pin 6 and 20 swapped in code